# Altium schematic sheet SH-C31G-V1.0.SchDoc
size 297 x 209 mm; Symbol: Sheet-Frame_A3; Border: 1; Title Block Position: 3; Width: 1170; Height: 825; Region Start: 1; X Region Count: 6; Y Region Count: 4; Blade Width: 10; @Board Name: SH-C31G_v1.0-20241223; @Create Time: 23:49:52; @Update Time: 11:02:26; Description: Sheet Settings; Version: V1.0; @Project Name: CANable; @Page Count: 1; @Create Date: 2024-11-14; @Page No: 1; @Page Name: P1_1; @Update Date: 2024-12-23; Company: DongGuan DESHIDE TECHNOLOGY CO., LTD; @Schematic Name: SH-C31G; Device: Sheet-Frame_A3
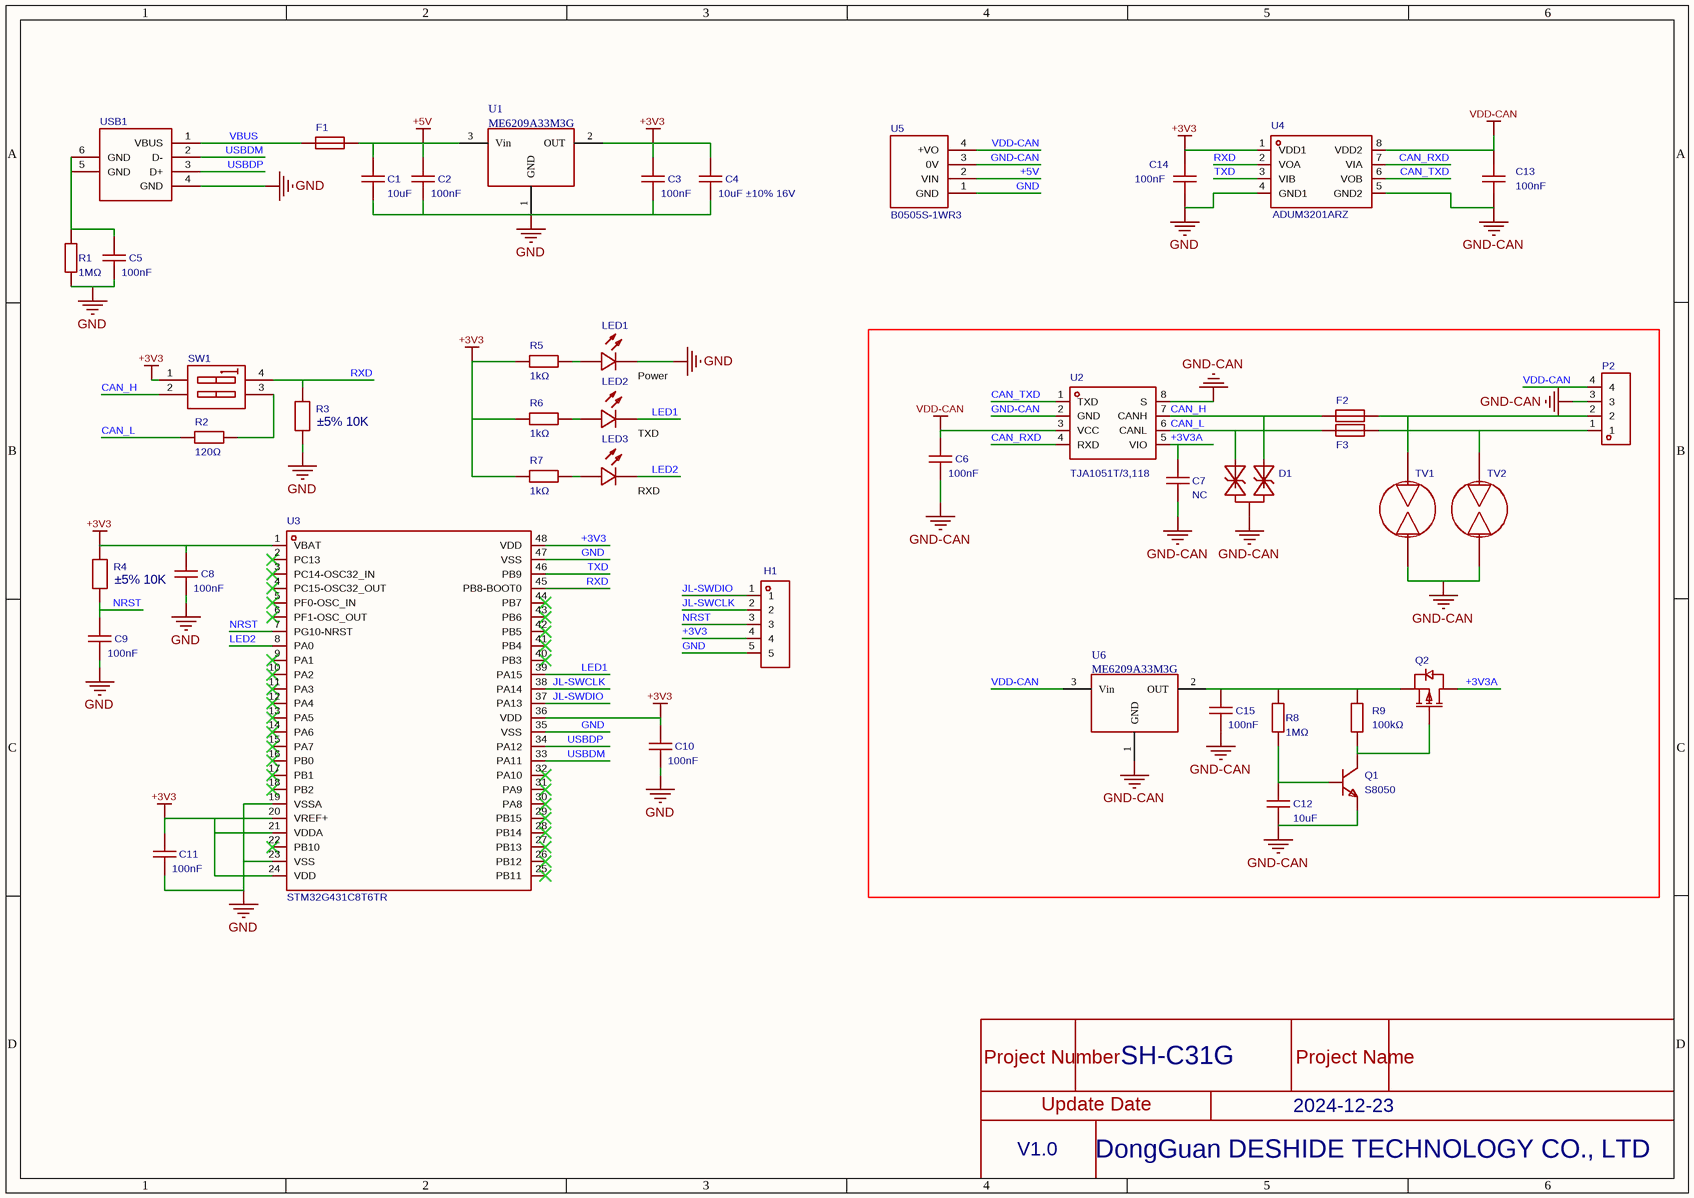
[diagram p0: SH-C31G-V1.0.SchDoc]

## Parts
C1  10uF  [C0805_1]
C2  100nF  [C0402_2]
C3  100nF  [C0402_2]
C4  LCSC Part Name: 10uF ±10% 16V  [C0805_1]  (hidden comment: 10uF)
C5  100nF  [C0402_2]
C6  100nF  [C0402_2]
C7  NC  [C0402_2]
C8  100nF  [C0402_2]
C9  100nF  [C0402_2]
C10  100nF  [C0402_2]
C11  100nF  [C0402_2]
C12  10uF  [C0805_1]
C13  value 100nF  [C0402]
C14  value 100nF  [C0402]
C15  100nF  [C0402_2]
D1  (no value)  [SOT-23-3_L2.9-W1.3-P1.90-LS2.4-BR]
F1  (no value)  [F0805]
F2  SMD1206B020TF/24  [F1206_1]  (value not drawn)
F3  SMD1206B020TF/24  [F1206_1]  (value not drawn)
H1  (no value)  [HDR-TH_5P-P2.54-V-M]
LED1  (no value)  [LED0603-RD_RED_1]
LED2  (no value)  [LED0603-RD]
LED3  (no value)  [LED0603-RD]
P2  WJ128V-5.0-4P  [CONN-TH_4P-P5.00_WJ128V-4P-5.0-14-00A]  (value not drawn)
Q1  S8050  [SOT-23_L2.9-W1.3-P1.90-LS2.4-BR]
Q2  SI2301  [SOT-23-3_L2.9-W1.3-P1.90-LS2.4-BR_2]  (value not drawn)
R1  value 1MΩ  [R0603]
R2  value 120Ω  [R0805]
R3  LCSC Part Name: ±5% 10K  [R0402]
R4  LCSC Part Name: ±5% 10K  [R0402]
R5  value 1kΩ  [R0402]
R6  value 1kΩ  [R0402]
R7  value 1kΩ  [R0402]
R8  value 1MΩ  [R0603]
R9  100kΩ  [R0603]
SW1  DP-02RP  [SW-TH_DP-02XP]  (value not drawn)
TV1  (no value)  [DIO-DT-SMD_L4.5-W3.2]
TV2  (no value)  [DIO-DT-SMD_L4.5-W3.2]
U1  ME6209A33M3G  [SOT-23(SOT-23-3)]
U2  TJA1051T/3,118  [SOIC-8_L4.9-W3.9-P1.27-LS6.0-BL]
U3  STM32G431C8T6TR  [LQFP-48_L7.0-W7.0-P0.50-LS9.0-BL_1]
U4  ADUM3201ARZ  [SOIC-8_L4.9-W3.9-P1.27-LS6.0-BL]
U5  Manufacturer Part: B0505S-1WR3  [PWRM-TH_B0503S-1WR2]  (hidden comment: B0505S-1WR3_C131038)
U6  ME6209A33M3G  [SOT-23(SOT-23-3)]
USB1  (no value)  [USB-B-TH_USB-B01]

## Nets
+3V3: C3.2 C4.2 C8.2 C10.2 C11.2 C14.2 H1.4 R4.2 R5.1 R6.1 R7.1 SW1.1(A1) U1.2(OUT) U3.1(VBAT) U3.20(VREF+) U3.21(VDDA) U3.24(VDD) U3.36(VDD) U3.48(VDD) U4.1(VDD1)
+5V: C1.2 C2.2 F1.2 U1.3(Vin) U5.2(VIN)
GND: C1.1 C2.1 C3.1 C4.1 C5.1 C8.1 C9.1 C10.1 C11.1 C14.1 H1.5 LED1.1(K) R1.1 R3.1 U1.1(GND) U3.19(VSSA) U3.23(VSS) U3.35(VSS) U3.47(VSS) U4.4(GND1) U5.1(GND) USB1.4(GND)
GND-CAN: C6.1 C7.1 C12.1 C13.1 C15.1 D1.3 P2.3 Q1.2(E) TV1.2 TV2.2 U2.2(GND) U2.8(S) U4.5(GND2) U5.3(0V) U6.1(GND)
VDD-CAN: C6.2 C13.2 P2.4 U2.3(VCC) U4.8(VDD2) U5.4(+VO) U6.3(Vin)
+3V3A: C7.2 Q2.3(D) U2.5(VIO)
CAN_H: D1.2 F2.1 SW1.2(A2) U2.7(CANH)
CAN_L: D1.1 F3.1 R2.1 U2.6(CANL)
CAN_RXD: U2.4(RXD) U4.7(VIA)
CAN_TXD: U2.1(TXD) U4.6(VOB)
JL-SWCLK: H1.2 U3.38(PA14)
JL-SWDIO: H1.1 U3.37(PA13)
LED1: LED2.1(K) U3.39(PA15)
LED2: LED3.1(K) U3.8(PA0)
NRST: C9.2 H1.3 R4.1 U3.7(PG10-NRST)
RXD: R3.2 SW1.4 U3.45(PB8-BOOT0) U4.2(VOA)
TXD: U3.46(PB9) U4.3(VIB)
USBDM: U3.33(PA11) USB1.2(D-)
USBDP: U3.34(PA12) USB1.3(D+)
VBUS: F1.1 USB1.1(VBUS)
NetC5_2: C5.2 R1.2 USB1.5(GND) USB1.6(GND)
NetC12_2: C12.2 Q1.1(B) R8.1
NetC15_2: C15.2 Q2.2(S) R8.2 R9.2 U6.2(OUT)
NetF2_2: F2.2 P2.2 TV1.1
NetF3_2: F3.2 P2.1 TV2.1
NetLED1_2: LED1.2(A) R5.2
NetLED2_2: LED2.2(A) R6.2
NetLED3_2: LED3.2(A) R7.2
NetQ1_3: Q1.3(C) Q2.1(G) R9.1
NetR2_2: R2.2 SW1.3

Not connected (* = marked no-connect by the designer): U3 2(PC13)* 3(PC14-OSC32_IN)* 4(PC15-OSC32_OUT)* 5(PF0-OSC_IN)* 6(PF1-OSC_OUT)* 9(PA1)* 10(PA2)* 11(PA3)* 12(PA4)* 13(PA5)* 14(PA6)* 15(PA7)* 16(PB0)* 17(PB1)* 18(PB2)* 22(PB10)* 25(PB11)* 26(PB12)* 27(PB13)* 28(PB14)* 29(PB15)* 30(PA8)* 31(PA9)* 32(PA10)* 40(PB3)* 41(PB4)* 42(PB5)* 43(PB6)* 44(PB7)*

## Notes on the sheet
- (near LED1) Power
- (near LED2) TXD
- (near LED3) RXD
- Project Number
- SH-C31G
- Project Name
- V1.0
- Update Date
- 2024-12-23
- DongGuan DESHIDE TECHNOLOGY CO., LTD

## Library data of the parts
C1 C4 C12 = CL21A106KOQNNNE: Capacitance:10uF;Tolerance:±10%;Rated Voltage:16V;Dielectric (Temp. Coefficient):X5R;; Manufacturer: SAMSUNG; AddInBom: yes; ModelId: 1ba041120af144c991958decab20d241; ModelName: C0805_L2.0-W1.3-H1.3; ModelTransform: 78.74,51.181,0,0,0,0,0,0.0005,0; Tolerance: ±10%; Voltage Rated: 16V; Temperature Coefficient: X5R; Value: 10uF; Device: CL21A106KOQNNNE; Symbol: CL21A106KOQNNNE; SupplierPart: C1713; ManufacturerPart: CL21A106KOQNNNE; Supplier Footprint: 0805; JLCPCB Part Class: Extended Part; Supplier: LCSC; ConvertToPcb: yes; FootprintName: C0805_1
  C1: LCSC Part Name: 10uF ±10% 16V; Datasheet: https://atta.szlcsc.com/upload/public/pdf/source/20160103/1457707694240.pdf
  C4: Datasheet: https://atta.szlcsc.com/upload/public/pdf/source/20160103/1457707694240.pdf
  C12: Datasheet: https://atta.szlcsc.com/upload/public/pdf/source/20160218/1457707763339.pdf; LCSC Part Name: 10uF ±10% 16V
C2 C3 C5 C6 C8-C11 C15 = 0402B104K250NT: Capacitance:100nF;Tolerance:±10%;Rated Voltage:25V;Dielectric (Temp. Coefficient):X7R;; Manufacturer: FH; AddInBom: yes; ModelId: 36a51122f27c49738f86b3bfa98863e0; ModelName: C0402_L1.0-W0.5-H0.5; ModelTransform: 39.37,19.685,0,0,0,0,0,0,0; Tolerance: ±10%; Voltage Rated: 25V; Temperature Coefficient: X7R; Value: 100nF; Device: 0402B104K250NT; Symbol: 0402B104K250NT; LCSC Part Name: 100nF ±10% 25V; SupplierPart: C56392; ManufacturerPart: 0402B104K250NT; Supplier Footprint: 0402; JLCPCB Part Class: Extended Part; Datasheet: https://atta.szlcsc.com/upload/public/pdf/source/20170923/C56392_1506149493292988842.pdf; Supplier: LCSC; ConvertToPcb: yes; FootprintName: C0402_2
C7 = 0402B104K250NT: Capacitance:100nF;Tolerance:±10%;Rated Voltage:25V;Dielectric (Temp. Coefficient):X7R;; Manufacturer: FH; Value: 100nF; AddInBom: yes; ModelId: 36a51122f27c49738f86b3bfa98863e0; ModelName: C0402_L1.0-W0.5-H0.5; ModelTransform: 39.37,19.685,0,0,0,0,0,0,0; Tolerance: ±10%; Voltage Rated: 25V; Temperature Coefficient: X7R; Device: 0402B104K250NT; Symbol: 0402B104K250NT; LCSC Part Name: 100nF ±10% 25V; SupplierPart: C56392; ManufacturerPart: 0402B104K250NT; Supplier Footprint: 0402; JLCPCB Part Class: Extended Part; Datasheet: https://atta.szlcsc.com/upload/public/pdf/source/20170923/C56392_1506149493292988842.pdf; Supplier: LCSC; ConvertToPcb: yes; FootprintName: C0402_2
C13 C14 = C0402X104K050T: Capacitance:100nF;Tolerance:±10%;Rated Voltage:50V;Temp. Coefficient:X7R;; Manufacturer: IHHEC; AddInBom: yes; ModelId: 36a51122f27c49738f86b3bfa98863e0; ModelName: C0402_L1.0-W0.5-H0.5; ModelTransform: 39.37,19.685,0,0,0,0,0,0,0; Tolerance: ±10%; Voltage Rated: 50V; Temperature Coefficient: X7R; Device: C0402X104K050T; Symbol: C0402X104K050T; LCSC Part Name: 100nF ±10% 50V; SupplierPart: C501838; ManufacturerPart: C0402X104K050T; Supplier Footprint: 0402; JLCPCB Part Class: Extended Part; Datasheet: https://atta.szlcsc.com/upload/public/pdf/source/20190313/C374174_331C86E4A68CC9C732DA87186AAF7F8A.pdf; Supplier: LCSC; ConvertToPcb: yes; FootprintName: C0402
D1 = TPPESD12VL2BT: Manufacturer: TECH PUBLIC; AddInBom: yes; ModelId: c62791f0466c4ae2a892c056b845b0ca; ModelName: SOT-23-3P_L2.9-W1.3-H1.0-LS2.4-P0.95; ModelTransform: 98.425,114.173,0,180,0,0,0.0005,-0.0005,0; Device: TPPESD12VL2BT; Symbol: TPPESD12VL2BT; LCSC Part Name: TPPESD12VL2BT; SupplierPart: C2682273; ManufacturerPart: TPPESD12VL2BT; Supplier Footprint: SOT-23-3; JLCPCB Part Class: Extended Part; Datasheet: https://atta.szlcsc.com/upload/public/pdf/source/20210810/22D0EE7AE03C1C968B9C50DDF599EB08.pdf; Supplier: LCSC; ConvertToPcb: yes; FootprintName: SOT-23-3_L2.9-W1.3-P1.90-LS2.4-BR
F1 = FSMD010-24-0805-R: Max Voltage:24V;Max Current:100A;Hold Current:100mA;Trip Current:300mA;; Manufacturer: FUZETEC; AddInBom: yes; ModelId: 57e2aa106f9143e8b6ab832aebb31c78; ModelName: F0805_L2.1-W1.4-H0.8; ModelTransform: 82.677,55.118,0,0,0,0,0.0005,0,0; Operating Voltage (Max): 24V; Current Rating (Max): 100A; Hold Current: 100mA; Trip Current: 300mA; Device: FSMD010-24-0805-R; Symbol: FSMD010-24-0805-R; LCSC Part Name: 0.1A 24V resettable fuse; SupplierPart: C220142; ManufacturerPart: FSMD010-24-0805-R; Supplier Footprint: 0805; JLCPCB Part Class: Extended Part; Datasheet: https://atta.szlcsc.com/upload/public/pdf/source/20180530/C220142_CDCC5931C174CCAFFDB29D784E09FABB.PDF; Supplier: LCSC; ConvertToPcb: yes; FootprintName: F0805
F2 F3 = SMD1206B020TF/24: Max Voltage:24V;Max Current:100A;Hold Current:200mA;Trip Current:420mA;Max Trip Time:100ms;; Manufacturer: Brightking; AddInBom: yes; ModelId: f1628daad26847a79b887277a2bc8541; ModelName: F1206_L3.2-W1.7-H0.6; ModelTransform: 125.984,66.929,0,0,0,0,0,0,0; Operating Voltage (Max): 24V; Current Rating (Max): 100A; Hold Current: 200mA; Trip Current: 420mA; Maximum Time to Trip: 100ms; Device: SMD1206B020TF/24; Symbol: SMD1206B020TF/24; LCSC Part Name: 24VDC 0.2A; SupplierPart: C269111; ManufacturerPart: SMD1206B020TF/24; Supplier Footprint: SMD; JLCPCB Part Class: Extended Part; Datasheet: https://atta.szlcsc.com/upload/public/pdf/source/20180817/C269111_B76553ADDD05C0EABB0A26C6D9A96E77.pdf; Supplier: LCSC; ConvertToPcb: yes; FootprintName: F1206_1
H1 = PZ254V-11-05P: Pitch:2.54mm;Total Pins:5;Rows:1;Pin Configuration:1x5P;Row Spacing:-;Mounting Type:Through Hole;Round Pin/Square Pin:Square Pin;Rated Current:-;Rated Voltage:-;Mating Pin Length:6mm;Insulator Height:2.5mm;Termination Pin Length:3mm;Contact Material:Brass;Contact Plating:-;Operating Temp. Range:-40~+105;Color:Black;; Manufacturer: XFCN; AddInBom: yes; ModelId: 47d466e4a34f4fc5bc626cf773a24dd5; ModelName: HDR-TH_5P-P2.54-M-LI-1X5P; ModelTransform: 499.999,100,0,0,0,0,0,0,-118.11; Pitch: 2.54mm; Pin Structure: 1x5P; Operating Temperature Range: -40~+105; Device: PZ254V-11-05P; Symbol: PZ254V-11-05P; LCSC Part Name: 2.54mm 1x5P; SupplierPart: C492404; ManufacturerPart: PZ254V-11-05P; Supplier Footprint: Through Hole,P=2.54mm; JLCPCB Part Class: Extended Part; Datasheet: https://atta.szlcsc.com/upload/public/pdf/source/20200309/C492404_E51533260F8710EFF5D4617281164C1D.pdf; Supplier: LCSC; ConvertToPcb: yes; FootprintName: HDR-TH_5P-P2.54-V-M; Number of Pins: 5; Number of Rows: 1; Row Spacing: -; Mounting Type: Through Hole; Circluar Pins/Square Pins: Square Pin; Current Rating (Max): -; Voltage Rating (Max): -; Length of Mating Pin: 6mm; Insulation Height: 2.5mm; Length of End Connection Pin: 3mm; Contact Material: Brass; Contact Plating: -; Color: Black
LED1 = NCD0603R1_C84263: Emitted Color:Red;; Manufacturer: NationStar; Symbol: FC-DA1608HRK-620D_1; AddInBom: yes; ModelId: 74041d3a270d435c8600a9ab9b7641c0; ModelName: LED0603-RD_RED; ModelTransform: 63.7794,31.496,0,0,0,0,0,0,0; Emitted Color: Red; Device: NCD0603R1_C84263; LCSC Part Name: Red; SupplierPart: C84263; ManufacturerPart: NCD0603R1; Supplier Footprint: 0603; JLCPCB Part Class: Extended Part; Datasheet: https://atta.szlcsc.com/upload/public/pdf/source/20200820/C84263_DABC6A75E58F576973B407FDBA283D60.pdf; Supplier: LCSC; ConvertToPcb: yes; FootprintName: LED0603-RD_RED_1
LED2 LED3 = NCD0603G1: Emitted Color:Emerald Green;; Manufacturer: NationStar; Symbol: FC-D1608UGK-520D10; AddInBom: yes; ModelId: 1f0d29a91be547639d425604e9b96ebb; ModelTransform: 63.7794,32.283,0,0,0,0,0,0,0; Device: NCD0603G1; LCSC Part Name: Emerald Green; SupplierPart: C84267; ManufacturerPart: NCD0603G1; Supplier Footprint: 0603; JLCPCB Part Class: Extended Part; Datasheet: https://atta.szlcsc.com/upload/public/pdf/source/20200820/C84267_04BA7703640BAC111D09F5EFB971FBF3.pdf; Supplier: LCSC; ConvertToPcb: yes; FootprintName: LED0603-RD; ModelName: LED0603-RD; Emitted Color: Emerald Green
P2 = WJ128V-5.0-4P: Pitch:5mm;Rows:1;Pins per Row:4;Mounting:Straight;Rated Current:20A;Rated Voltage:250V;Wire Gauge - AWG:12~22;Wire Gauge - mm?:2.5;Operating Temp. Range:-40℃~+105℃;Color:Green;; Manufacturer: KANGNEX; Symbol: WJ128V-4P-5.0-14-00A; AddInBom: yes; ModelId: cfcf1d8cbec746899afb5ab743e84074; ModelName: CONN-TH_WJ5.00-LI-4P-128; ModelTransform: 807.0748,405.511,0,0,0,0,-7.874,-5.315,-157.48; Pitch: 5mm; Number of PINs Per Row: 4; Current Rating (Max): 20A; Voltage Rating (Max): 250V; Wire Gauge - AWG: 12~22; Wire Gauge - mm?: 2.5; Device: WJ128V-5.0-4P; LCSC Part Name: 5mm Rows:1 Pins per Row:4 Straight stackable; SupplierPart: C192769; ManufacturerPart: WJ128V-5.0-4P; Supplier Footprint: Through Hole,P=5mm; JLCPCB Part Class: Extended Part; Datasheet: https://atta.szlcsc.com/upload/public/pdf/source/20191225/C192769_677B15EBBD9FD2D22E696A4E109D0907.pdf; Supplier: LCSC; ConvertToPcb: yes; FootprintName: CONN-TH_4P-P5.00_WJ128V-4P-5.0-14-00A; Number of Rows: 1; Mounting Style: Straight; Operating Temperature Range: -40℃~+105℃; Color: Green
Q1 = S8050_C444723: Transistor Type:NPN;Collector-Emitter Breakdown Voltage(Vceo):25V;Collector Current(Ic):500mA;Power(Pd):300mW;Collector-Emitter Saturation Voltage(VCE(sat)@Ic,Ib):600mV@500mA,50mA;DC Current Gain(hFE@Ic,Vce):-;Transition Frequency(fT):150MHz;Operating Temp.:+150℃@(Tj);; Manufacturer: Slkor; AddInBom: yes; ModelId: c62791f0466c4ae2a892c056b845b0ca; ModelName: SOT-23-3P_L2.9-W1.3-H1.0-LS2.4-P0.95; ModelTransform: 98.64468,114.173,0,180,0,0,0,0,0; Transistor Type: NPN; Collector-Emitter Breakdown Voltage (Vceo): 25V; Collector Current (Ic): 500mA; Power Dissipation (Pd): 300mW; Transition Frequency (fT): 150MHz; Manufacturer Part: S8050; Device: S8050_C444723; Symbol: S8050_C444723; LCSC Part Name: S8050SOT-23 SOT-23; SupplierPart: C444723; Supplier Footprint: SOT-23; JLCPCB Part Class: Extended Part; Datasheet: https://atta.szlcsc.com/upload/public/pdf/source/20191106/C444723_63F3CBA9B7EFAA36D3929F9CC524D030.pdf; Supplier: LCSC; ConvertToPcb: yes; FootprintName: SOT-23_L2.9-W1.3-P1.90-LS2.4-BR; Collector-Emitter Saturation Voltage (VCE(sat)@Ic,Ib): 600mV@500mA,50mA; DC Current Gain (hFE@Ic,Vce): -; Operating Temperature: +150℃@(Tj)
Q2 = SI2301_C2891731: Type:P-channel;Drain-Source Voltage(Vdss):20V;Continuous Drain Current(Id):2.2A;Power(Pd):700mW;On-Resistance(RDS(on)@Vgs,Id):90mΩ@4.5V,1.5A;Threshold Voltage(Vgs(th)@Id):620mV@250uA;Operating Temp.:+150℃@(Tj);; Manufacturer: YONGYUTAI; AddInBom: yes; ModelId: c62791f0466c4ae2a892c056b845b0ca; ModelName: SOT-23-3P_L2.9-W1.3-H1.0-LS2.4-P0.95; ModelTransform: 98.425,114.173,0,180,0,0,0.0005,-0.0005,0; Drain Source Voltage (Vdss): 20V; Continuous Drain Current (Id): 2.2A; Power Dissipation (Pd): 700mW; Device: SI2301_C2891731; Symbol: SI2301_C2891731; LCSC Part Name: P-channel 20V 2.2A; SupplierPart: C2891731; ManufacturerPart: SI2301; Supplier Footprint: SOT-23; JLCPCB Part Class: Extended Part; Datasheet: https://atta.szlcsc.com/upload/public/pdf/source/20210901/BD7F488CADB80954861F21BEE026F08A.pdf; Supplier: LCSC; ConvertToPcb: yes; FootprintName: SOT-23-3_L2.9-W1.3-P1.90-LS2.4-BR_2; Type: P-channel; Drain Source On Resistance (RDS(on)@Vgs,Id): 90mΩ@4.5V,1.5A; Gate Threshold Voltage (Vgs(th)@Id): 620mV@250uA; Operating Temperature: +150℃@(Tj)
R1 R8 = 0603WAJ0105T5E: Resistor Type:Thick Film Resistor;Resistance:1MΩ;Tolerance:±5%;Power:1/10W;Temp. Coefficient:±100ppm/;Max Working Voltage:75V;Operating Temp. Range:-55~+155;; Manufacturer: UNI-ROYAL; AddInBom: yes; ModelId: 3281a289d46d4bb1877be1eabd090e13; ModelName: R0603_L1.6-W0.8-H0.8; ModelTransform: 62.992,31.496,0,0,0,0,0,0,0; Tolerance: ±5%; Power(Watts): 1/10W; Overload Voltage (Max): 75V; Temperature Coefficient: ±100ppm/; Operating Temperature Range: -55~+155; Device: 0603WAJ0105T5E; Symbol: 0603WAJ0105T5E; LCSC Part Name: 1MΩ ±5%; SupplierPart: C26098; ManufacturerPart: 0603WAJ0105T5E; Supplier Footprint: 0603; JLCPCB Part Class: Extended Part; Datasheet: https://atta.szlcsc.com/upload/public/pdf/source/20200306/C422600_1E6D84923E4A46A82E41ADD87F860B5C.pdf; Supplier: LCSC; ConvertToPcb: yes; FootprintName: R0603; Type: Thick Film Resistor
R2 = TC0525F1200T5E: Resistor Type:Thin Film Resistor;Resistance:120Ω;Tolerance:±1%;Power:250mW;Temp. Coefficient:±25ppm/;Max Working Voltage:150V;Operating Temp. Range:-55~+155;; Manufacturer: UNI-ROYAL; Temperature Coefficient: ±25ppm/; AddInBom: yes; ModelId: 37a81e68749a4138bd2dfa6897b24b85; ModelName: R0805_L2.0-W1.3-H0.6; ModelTransform: 78.74,51.181,0,0,0,0,0,-0.0005,0; Tolerance: ±1%; Power(Watts): 250mW; Overload Voltage (Max): 150V; Operating Temperature Range: -55~+155; Device: TC0525F1200T5E; Symbol: TC0525F1200T5E; LCSC Part Name: 120Ω ±1%; SupplierPart: C61683; ManufacturerPart: TC0525F1200T5E; Supplier Footprint: 0805; JLCPCB Part Class: Extended Part; Datasheet: https://atta.szlcsc.com/upload/public/pdf/source/20190404/C61683_83EF7BF6E2DB2C00969A8D3769A56445.pdf; Supplier: LCSC; ConvertToPcb: yes; FootprintName: R0805; Type: Thin Film Resistor
R3 R4 = SCR0402J10K: Manufacturer: VO; AddInBom: yes; ModelId: 671aefced39d4c318694bba8bd8efd39; ModelName: R0402_L1.0-W0.5-H0.5; ModelTransform: 39.37,19.685,0,0,0,0,0,0.0005,0; Device: SCR0402J10K; Symbol: SCR0402J10K; SupplierPart: C3017497; Supplier Footprint: 0402; JLCPCB Part Class: Extended Part; Datasheet: https://atta.szlcsc.com/upload/public/pdf/source/20220513/247AF9639BA21CF93567DC289CCC6A22.pdf; Supplier: LCSC; ConvertToPcb: yes; FootprintName: R0402
  R3: Manufacturer Part: SCR0402J10K
  R4: ManufacturerPart: SCR0402J10K
R5-R7 = RC0402JR-071KL: Resistance:1kΩ;Tolerance:±5%;Power:1/16W;Temp. Coefficient:±100ppm/;Max Working Voltage:50V;Operating Temp. Range:-55~+155;; Manufacturer: YAGEO; AddInBom: yes; ModelId: 671aefced39d4c318694bba8bd8efd39; ModelName: R0402_L1.0-W0.5-H0.5; ModelTransform: 39.37,19.685,0,0,0,0,0,0.0005,0; Tolerance: ±5%; Power(Watts): 1/16W; Overload Voltage (Max): 50V; Device: RC0402JR-071KL; Temperature Coefficient: ±100ppm/; Operating Temperature Range: -55~+155; Symbol: RC0402JR-071KL; LCSC Part Name: 1kΩ ±5%; SupplierPart: C105637; ManufacturerPart: RC0402JR-071KL; Supplier Footprint: 0402; JLCPCB Part Class: Extended Part; Datasheet: https://atta.szlcsc.com/upload/public/pdf/source/20170518/1495085707603.pdf; Supplier: LCSC; ConvertToPcb: yes; FootprintName: R0402
R9 = 0603WAJ0104T5E: Resistor Type:Thick Film Resistor;Resistance:100kΩ;Tolerance:±5%;Power:100mW;; Manufacturer: UNI-ROYAL; AddInBom: yes; ModelId: fc143cca1e79419f9cd78b61e9279f08; ModelTransform: 31.8897,63.7794,0,90,0,0,0,0,0; Tolerance: ±5%; Power(Watts): 100mW; Temperature Coefficient: ±100ppm/℃; Overload Voltage (Max): 75V; Value: 100kΩ; Device: 0603WAJ0104T5E; Symbol: 0603WAJ0104T5E; LCSC Part Name: 100kΩ ±5% 100mW; SupplierPart: C15458; ManufacturerPart: 0603WAJ0104T5E; Supplier Footprint: 0603; JLCPCB Part Class: Extended Part; Datasheet: https://atta.szlcsc.com/upload/public/pdf/source/20200306/C422600_1E6D84923E4A46A82E41ADD87F860B5C.pdf; Supplier: LCSC; ConvertToPcb: yes; FootprintName: R0603; ModelName: R0603; Type: Thick Film Resistor; Operating Temperature Range: -55℃~+155℃
SW1 = DP-02RP: Type:Piano Key;Rated Current:25mA;Rated Voltage:24V;Circuit:SPST;Positions:2;Pin Pitch:2.54mm;Operating Temp.:-20℃~+70℃;Service Life:3000;Color:Red;; Manufacturer: HRO; AddInBom: yes; ModelId: f5e453c164544a96b2961ad153ad33d6; ModelName: SW-TH_DP-02XP-L6.5-W12.4-H9.7-P2.54; ModelTransform: 257.4798,488.188,0,0,0,0,0,-33.583,-157.48; Current Rating: 25mA; Voltage Rating: 24V; Circuit: SPST; Number of Positions: 2; Operating Life: 3000; Device: DP-02RP; Symbol: DP-02RP; LCSC Part Name: Red 2-position 2.54mm through-hole side-actuated DIP switch; SupplierPart: C129041; ManufacturerPart: DP-02RP; Supplier Footprint: Through Hole; JLCPCB Part Class: Extended Part; Datasheet: https://atta.szlcsc.com/upload/public/pdf/source/20210810/79AA2E1F6EDC519505AF8DF4F29ADEEB.pdf; Supplier: LCSC; ConvertToPcb: yes; FootprintName: SW-TH_DP-02XP; Type: Piano Key; Lead Pitch: 2.54mm; Operating Temperature: -20℃~+70℃; Color: Red
TV1 TV2 = SMD4532-090NF: Electrodes:2;DC Breakdown Voltage:90V;Tolerance:±30%;Pulse Discharge Current:3kA;Interelectrode Capacitance:0.5pF;; Manufacturer: RUILON; AddInBom: yes; ModelId: 3e98048e62f042eda67deea78d2be460; ModelName: DIO-DT_L4.5-W3.2-H2.7; ModelTransform: 177.2,126,0,0,0,0,0,0,0; Number of Poles: 2; DC Spark-over Voltage: 90V; Tolerance: ±30%; Nominal Impulse Discharge Current: 3kA; Maximum Capacitance @ 1MHz: 0.5pF; Device: SMD4532-090NF; Symbol: SMD4532-090NF; LCSC Part Name: 90V; SupplierPart: C9235; ManufacturerPart: SMD4532-090NF; Supplier Footprint: 1812; JLCPCB Part Class: Extended Part; Datasheet: https://atta.szlcsc.com/upload/public/pdf/source/20140725/1457707194440.pdf; Supplier: LCSC; ConvertToPcb: yes; FootprintName: DIO-DT-SMD_L4.5-W3.2
U1 U6 = ME6209A33M3G: ConvertToPcb: yes; Origin Footprint: SOT-23(SOT-23-3); Device: ME6209A33M3G; Symbol: ME6209A33M3G; AddInBom: yes
U2 = TJA1051T/3,118: Type:-;; Manufacturer: NXP; AddInBom: yes; ModelId: e81d2f7d937b4a6ab1dca543ff5d56a4; ModelName: SOIC-8_L4.9-W3.9-H1.7-LS6.0-P1.27; ModelTransform: 189.751,236.22,0,0,0,0,0.0005,0.0005,0; Manufacturer Part: TJA1051T/3,118; Device: TJA1051T/3,118; Symbol: TJA1051T/3,118; LCSC Part Name: TJA1051T/3,118; SupplierPart: C58988; Supplier Footprint: SOIC-8; JLCPCB Part Class: Extended Part; Datasheet: https://atta.szlcsc.com/upload/public/pdf/source/20220802/B41F59DF1B299A7C26D22B2702AC2509.pdf; Supplier: LCSC; ConvertToPcb: yes; FootprintName: SOIC-8_L4.9-W3.9-P1.27-LS6.0-BL; Type: -
U3 = STM32G431C8T6TR: Manufacturer: ST; AddInBom: yes; ModelId: 093be70396ff421eb2cdb946d5311efc; ModelName: LQFP-48_L7.0-W7.0-H1.4-LS9.0-P0.50; ModelTransform: 354.331,354.331,0,0,0,0,0,0,0; Manufacturer Part: STM32G431C8T6TR; Device: STM32G431C8T6TR; Symbol: STM32G431C8T6TR; LCSC Part Name: STM32G431C8T6TR; SupplierPart: C3227259; Supplier Footprint: LQFP-48(7x7); Datasheet: https://atta.szlcsc.com/upload/public/pdf/source/20220721/1CD68AFBB09CF27B558BAB01AF5E1EB5.pdf; Supplier: LCSC; ConvertToPcb: yes; FootprintName: LQFP-48_L7.0-W7.0-P0.50-LS9.0-BL_1
U4 = ADUM3201ARZ: Application:-;Isolation Technology:-;Voltage Isolation:-;; Manufacturer: ADI / LINEAR; AddInBom: yes; ModelId: e81d2f7d937b4a6ab1dca543ff5d56a4; ModelName: SOIC-8_L4.9-W3.9-H1.7-LS6.0-P1.27; ModelTransform: 189.751,236.22,0,0,0,0,0.0005,0.0005,0; Manufacturer Part: ADUM3201ARZ; Device: ADUM3201ARZ; Symbol: ADUM3201ARZ; LCSC Part Name: ADUM3201ARZ; SupplierPart: C660765; Supplier Footprint: SOIC-8; JLCPCB Part Class: Extended Part; Datasheet: https://atta.szlcsc.com/upload/public/pdf/source/20180524/C208140_3A204B629C98CB85777430D6F21BA479.pdf; Supplier: LCSC; ConvertToPcb: yes; FootprintName: SOIC-8_L4.9-W3.9-P1.27-LS6.0-BL; Applications: -; Isolation Technology: -; Voltage Isolation or Not: -
U5 = B0505S-1WR3_C131038: Conversion Type:DC-DC;Isolated Regulation:Isolated, unregulated;Number of Outputs:1;Input Voltage (DC):4.5V~5.5V;Output Voltage:5V;Output Current (max):200mA;Output Power:1W;Conversion Efficiency:82%;Characteristics:Short-Circuit Protection;Max Capacitive Load:-;; Manufacturer: MORNSUN; Symbol: B0505S-1WR3_1; AddInBom: yes; ModelId: d17bf056fb5b4095b162347dac51799f; ModelName: PWRM-TH_L11.6-W6.0-H10.2-P2.54; ModelTransform: 456.692,236.259,0,0,0,0,0,82.795,-137.795; Conversion Type: DC-DC; Output Channel: 1; Output Voltage: 5V; Output Current (Max): 200mA; Output Power: 1W; Conversion Efficiency: 82%; Device: B0505S-1WR3_C131038; LCSC Part Name: Vin=4.5V~5.5V Vout=5V 200mA; SupplierPart: C131038; Supplier Footprint: Through Hole; JLCPCB Part Class: Extended Part; Datasheet: https://atta.szlcsc.com/upload/public/pdf/source/20170919/C131038_1505787247657976982.pdf; Supplier: LCSC; ConvertToPcb: yes; FootprintName: PWRM-TH_B0503S-1WR2; Function: -; Isolated Or Voltage Regulation: Isolated, unregulated; Input Voltage(DC): 4.5V~5.5V; Feature: Short-Circuit Protection; Maximum Capacitive Load: -
USB1 = USB-B01: Connector Type:Type-B;Standard:USB 2.0;Gender:receptacle;Contacts:4;Ports:1;Mounting:Right-angle through hole;Rated Current - Power:-;Operating Temp. Range:-;; Manufacturer: SOFNG; AddInBom: yes; ModelId: 114ce80f03154dcc9f53637e65f34174; ModelTransform: 570.9,651.6,0,180,0,0,0,177.2,-137.8; Connector Type: Type-B; Number of Contacts: 4; Number of Ports: 1; Manufacturer Part: USB-B01; Device: USB-B01; Symbol: USB-B01; LCSC Part Name: Type-B receptacle Right-angle through hole; SupplierPart: C498173; Supplier Footprint: Through Hole; JLCPCB Part Class: Extended Part; Datasheet: https://atta.szlcsc.com/upload/public/pdf/source/20200812/C498173_CFDA774068C8841191F9DEBD85971FB5.pdf; Supplier: LCSC; ConvertToPcb: yes; FootprintName: USB-B-TH_USB-B01; ModelName: USB-B-TH_USB-B01; Standard: USB 2.0; Gender: receptacle; Mounting Style: Right-angle through hole; Current Rating - Power (Max): -; Operating Temperature Range: -